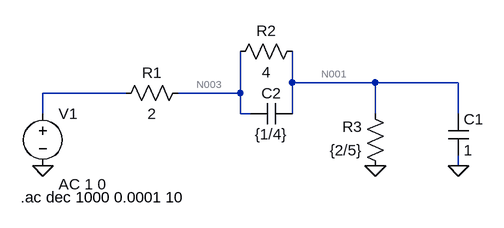
[diagram p0: schematic ej2b.asc]
ej2b.asc, the LTspice schematic file:
Version 4
SHEET 1 880 680
WIRE 272 128 272 80
WIRE 400 128 272 128
WIRE 528 128 400 128
WIRE 16 144 -112 144
WIRE 192 144 192 80
WIRE 192 144 96 144
WIRE -112 176 -112 144
WIRE 192 176 192 144
WIRE 208 176 192 176
WIRE 272 176 272 128
WIRE 400 176 400 128
WIRE 528 176 528 128
WIRE 528 256 528 240
FLAG -112 256 0
FLAG 400 256 0
FLAG 528 256 0
SYMBOL voltage -112 160 R0
WINDOW 123 24 124 Left 2
WINDOW 39 0 0 Left 0
SYMATTR InstName V1
SYMATTR Value ""
SYMATTR Value2 AC 1 0
SYMBOL res 112 128 R90
WINDOW 0 0 56 VBottom 2
WINDOW 3 32 56 VTop 2
SYMATTR InstName R1
SYMATTR Value 2
SYMBOL res 288 64 R90
WINDOW 0 0 56 VBottom 2
WINDOW 3 32 56 VTop 2
SYMATTR InstName R2
SYMATTR Value 4
SYMBOL res 416 272 R180
WINDOW 0 36 76 Left 2
WINDOW 3 36 40 Left 2
SYMATTR InstName R3
SYMATTR Value {2/5}
SYMBOL cap 512 176 R0
SYMATTR InstName C1
SYMATTR Value 1
SYMBOL cap 272 160 R90
WINDOW 0 0 32 VBottom 2
WINDOW 3 32 32 VTop 2
SYMATTR InstName C2
SYMATTR Value {1/4}
TEXT -146 304 Left 2 !.ac dec 1000 0.0001 10

The netlist it stands for:
* ej2b.asc
V1 N002 0 AC 1 0
R1 N003 N002 2
R2 N001 N003 4
R3 0 N001 {2/5}
C1 N001 0 1
C2 N001 N003 {1/4}
.ac dec 1000 0.0001 10
.backanno
.end

* Results of the author's LTspice run, read from the files saved beside the schematic
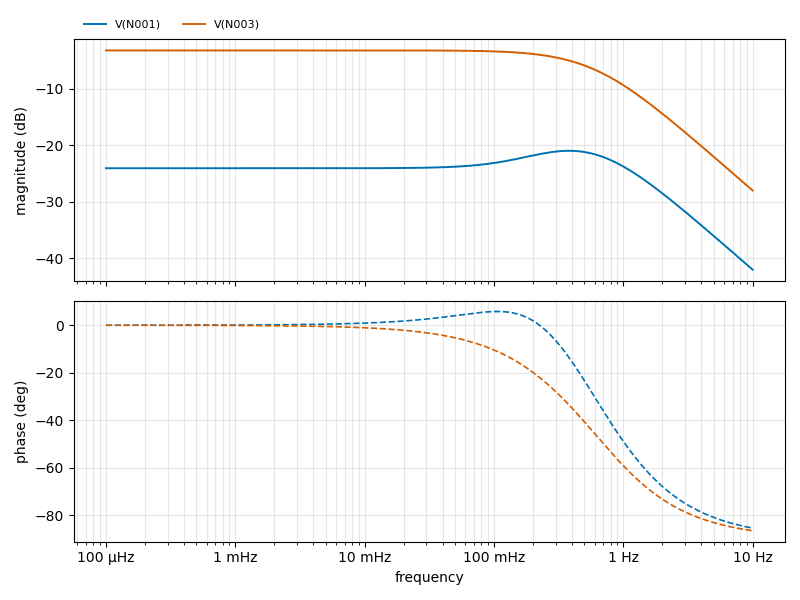
[diagram p1: AC Analysis of ej2b.asc, plotted from the saved traces]
* AC Analysis, 1 run:
*   V(N001): -24.08 dB at 100 µHz, -42.01 dB at 10 Hz, peak -20.99 dB at 380.2 mHz, 3 dB below the peak at 26.28 mHz and 1.041 Hz
*   V(N003): -3.25 dB at 100 µHz, -28.02 dB at 10 Hz, peak -3.25 dB at 100 µHz, 3 dB below the peak at 547.8 mHz